# Altium schematic sheet amps.SchDoc
size 209 x 297 mm; SheetNumber: 2; SheetTotal: 2
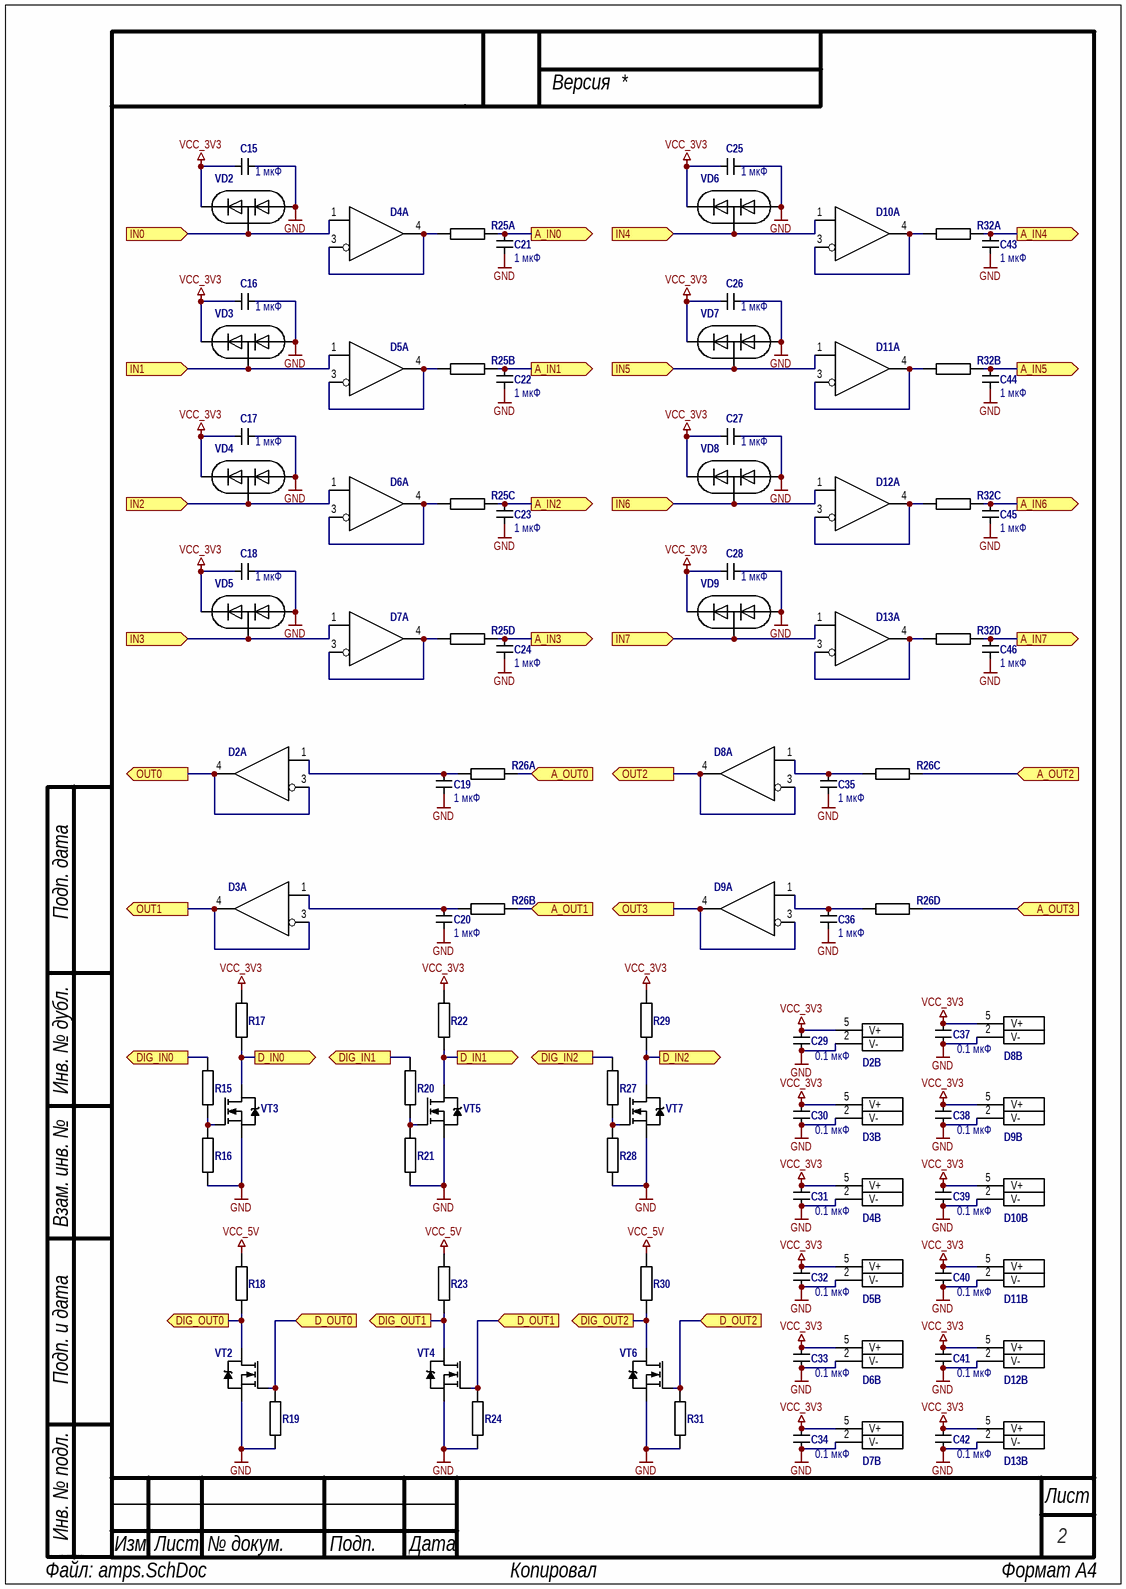
[diagram p0: amps.SchDoc]

## Parts
C15  value 1 мкФ  [CAPC1608X08L]  (hidden comment: C0603_16v_1u)
C16  value 1 мкФ  [CAPC1608X08L]  (hidden comment: C0603_16v_1u)
C17  value 1 мкФ  [CAPC1608X08L]  (hidden comment: C0603_16v_1u)
C18  value 1 мкФ  [CAPC1608X08L]  (hidden comment: C0603_16v_1u)
C19  value 1 мкФ  [CAPC1608X08L]  (hidden comment: C0603_16v_1u)
C20  value 1 мкФ  [CAPC1608X08L]  (hidden comment: C0603_16v_1u)
C21  value 1 мкФ  [CAPC1608X08L]  (hidden comment: C0603_16v_1u)
C22  value 1 мкФ  [CAPC1608X08L]  (hidden comment: C0603_16v_1u)
C23  value 1 мкФ  [CAPC1608X08L]  (hidden comment: C0603_16v_1u)
C24  value 1 мкФ  [CAPC1608X08L]  (hidden comment: C0603_16v_1u)
C25  value 1 мкФ  [CAPC1608X08L]  (hidden comment: C0603_16v_1u)
C26  value 1 мкФ  [CAPC1608X08L]  (hidden comment: C0603_16v_1u)
C27  value 1 мкФ  [CAPC1608X08L]  (hidden comment: C0603_16v_1u)
C28  value 1 мкФ  [CAPC1608X08L]  (hidden comment: C0603_16v_1u)
C29  value 0.1 мкФ  [CAPC1608X08L]  (hidden comment: C0603_50v_0,1u)
C30  value 0.1 мкФ  [CAPC1608X08L]  (hidden comment: C0603_50v_0,1u)
C31  value 0.1 мкФ  [CAPC1608X08L]  (hidden comment: C0603_50v_0,1u)
C32  value 0.1 мкФ  [CAPC1608X08L]  (hidden comment: C0603_50v_0,1u)
C33  value 0.1 мкФ  [CAPC1608X08L]  (hidden comment: C0603_50v_0,1u)
C34  value 0.1 мкФ  [CAPC1608X08L]  (hidden comment: C0603_50v_0,1u)
C35  value 1 мкФ  [CAPC1608X08L]  (hidden comment: C0603_16v_1u)
C36  value 1 мкФ  [CAPC1608X08L]  (hidden comment: C0603_16v_1u)
C37  value 0.1 мкФ  [CAPC1608X08L]  (hidden comment: C0603_50v_0,1u)
C38  value 0.1 мкФ  [CAPC1608X08L]  (hidden comment: C0603_50v_0,1u)
C39  value 0.1 мкФ  [CAPC1608X08L]  (hidden comment: C0603_50v_0,1u)
C40  value 0.1 мкФ  [CAPC1608X08L]  (hidden comment: C0603_50v_0,1u)
C41  value 0.1 мкФ  [CAPC1608X08L]  (hidden comment: C0603_50v_0,1u)
C42  value 0.1 мкФ  [CAPC1608X08L]  (hidden comment: C0603_50v_0,1u)
C43  value 1 мкФ  [CAPC1608X08L]  (hidden comment: C0603_16v_1u)
C44  value 1 мкФ  [CAPC1608X08L]  (hidden comment: C0603_16v_1u)
C45  value 1 мкФ  [CAPC1608X08L]  (hidden comment: C0603_16v_1u)
C46  value 1 мкФ  [CAPC1608X08L]  (hidden comment: C0603_16v_1u)
D2  AMP  [SOT23-5M]  (value not drawn)  (parts A,B of 2)
D3  AMP  [SOT23-5M]  (value not drawn)  (parts A,B of 2)
D4  AMP  [SOT23-5M]  (value not drawn)  (parts A,B of 2)
D5  AMP  [SOT23-5M]  (value not drawn)  (parts A,B of 2)
D6  AMP  [SOT23-5M]  (value not drawn)  (parts A,B of 2)
D7  AMP  [SOT23-5M]  (value not drawn)  (parts A,B of 2)
D8  AMP  [SOT23-5M]  (value not drawn)  (parts A,B of 2)
D9  AMP  [SOT23-5M]  (value not drawn)  (parts A,B of 2)
D10  AMP  [SOT23-5M]  (value not drawn)  (parts A,B of 2)
D11  AMP  [SOT23-5M]  (value not drawn)  (parts A,B of 2)
D12  AMP  [SOT23-5M]  (value not drawn)  (parts A,B of 2)
D13  AMP  [SOT23-5M]  (value not drawn)  (parts A,B of 2)
R15  RES0603_100r  [RESC1608X04N]  (value not drawn)
R16  RES0603_10k  [RESC1608X04N]  (value not drawn)
R17  RES0603_10k  [RESC1608X04N]  (value not drawn)
R18  RES0603_10k  [RESC1608X04N]  (value not drawn)
R19  RES0603_10k  [RESC1608X04N]  (value not drawn)
R20  RES0603_100r  [RESC1608X04N]  (value not drawn)
R21  RES0603_10k  [RESC1608X04N]  (value not drawn)
R22  RES0603_10k  [RESC1608X04N]  (value not drawn)
R23  RES0603_10k  [RESC1608X04N]  (value not drawn)
R24  RES0603_10k  [RESC1608X04N]  (value not drawn)
R25  CAT16-470J4  [CAC-80P320X160-8N]  (value not drawn)  (parts A,B,C,D of 4)
R26  CAT16-470J4  [CAC-80P320X160-8N]  (value not drawn)  (parts A,B,C,D of 4)
R27  RES0603_100r  [RESC1608X04N]  (value not drawn)
R28  RES0603_10k  [RESC1608X04N]  (value not drawn)
R29  RES0603_10k  [RESC1608X04N]  (value not drawn)
R30  RES0603_10k  [RESC1608X04N]  (value not drawn)
R31  RES0603_10k  [RESC1608X04N]  (value not drawn)
R32  CAT16-470J4  [CAC-80P320X160-8N]  (value not drawn)  (parts A,B,C,D of 4)
VD2  BAV199  [SOT95P245X110-3N]  (value not drawn)
VD3  BAV199  [SOT95P245X110-3N]  (value not drawn)
VD4  BAV199  [SOT95P245X110-3N]  (value not drawn)
VD5  BAV199  [SOT95P245X110-3N]  (value not drawn)
VD6  BAV199  [SOT95P245X110-3N]  (value not drawn)
VD7  BAV199  [SOT95P245X110-3N]  (value not drawn)
VD8  BAV199  [SOT95P245X110-3N]  (value not drawn)
VD9  BAV199  [SOT95P245X110-3N]  (value not drawn)
VT2  IRLML2402  [SOT95P245X110-3N]  (value not drawn)
VT3  IRLML2402  [SOT95P245X110-3N]  (value not drawn)
VT4  IRLML2402  [SOT95P245X110-3N]  (value not drawn)
VT5  IRLML2402  [SOT95P245X110-3N]  (value not drawn)
VT6  IRLML2402  [SOT95P245X110-3N]  (value not drawn)
VT7  IRLML2402  [SOT95P245X110-3N]  (value not drawn)

## Ports
A_IN0 (out, see main[2B]), A_IN1 (out, see main[2B]), A_IN2 (out, see main[2B]), A_IN3 (out, see main[2B]), A_IN4 (out, see main[2B]), A_IN5 (out, see main[2B]), A_IN6 (out, see main[2B]), A_IN7 (out, see main[2B]), A_OUT0 (in, see main[2B]), A_OUT1 (in, see main[2B]), A_OUT2 (in, see main[2B]), A_OUT3 (in, see main[2B]), D_IN0 (out, see main[2B]), D_IN1 (out, see main[2B]), D_IN2 (out, see main[2B]), D_OUT0 (in, see main[2B]), D_OUT1 (in, see main[2B]), D_OUT2 (in, see main[2B]), DIG_IN0 (out, see main[1B]), DIG_IN1 (out, see main[1B]), DIG_IN2 (out, see main[1B]), DIG_OUT0 (out, see main[1B]), DIG_OUT1 (out, see main[1B]), DIG_OUT2 (out, see main[1B]), IN0 (in, see main[1B]), IN1 (in, see main[1B]), IN2 (in, see main[1B]), IN3 (in, see main[1B]), IN4 (in, see main[1B]), IN5 (in, see main[1B]), IN6 (in, see main[1B]), IN7 (in, see main[1B]), OUT0 (out, see main[1B]), OUT1 (out, see main[1B]), OUT2 (out, see main[1B]), OUT3 (out, see main[1B])

## Nets
GND: C15.1 C16.1 C17.1 C18.1 C19.1 C20.1 C21.1 C22.1 C23.1 C24.1 C25.1 C26.1 C27.1 C28.1 C29.1 C30.1 C31.1 C32.1 C33.1 C34.1 C35.1 C36.1 C37.1 C38.1 C39.1 C40.1 C41.1 C42.1 C43.1 C44.1 C45.1 C46.1 D2.2(V-) D3.2(V-) D4.2(V-) D5.2(V-) D6.2(V-) D7.2(V-) D8.2(V-) D9.2(V-) D10.2(V-) D11.2(V-) D12.2(V-) D13.2(V-) R16.1 R19.1 R21.1 R24.1 R28.1 R31.1 VD2.1(A) VD3.1(A) VD4.1(A) VD5.1(A) VD6.1(A) VD7.1(A) VD8.1(A) VD9.1(A) VT2.2(Source) VT3.2(Source) VT4.2(Source) VT5.2(Source) VT6.2(Source) VT7.2(Source)
VCC_3V3: C15.2 C16.2 C17.2 C18.2 C25.2 C26.2 C27.2 C28.2 C29.2 C30.2 C31.2 C32.2 C33.2 C34.2 C37.2 C38.2 C39.2 C40.2 C41.2 C42.2 D2.5(V+) D3.5(V+) D4.5(V+) D5.5(V+) D6.5(V+) D7.5(V+) D8.5(V+) D9.5(V+) D10.5(V+) D11.5(V+) D12.5(V+) D13.5(V+) R17.2 R22.2 R29.2 VD2.2(K) VD3.2(K) VD4.2(K) VD5.2(K) VD6.2(K) VD7.2(K) VD8.2(K) VD9.2(K)
VCC_5V: R18.2 R23.2 R30.2
A_IN0: C21.2 R25.8 ; port A_IN0
A_IN1: C22.2 R25.7 ; port A_IN1
A_IN2: C23.2 R25.6 ; port A_IN2
A_IN3: C24.2 R25.5 ; port A_IN3
A_IN4: C43.2 R32.8 ; port A_IN4
A_IN5: C44.2 R32.7 ; port A_IN5
A_IN6: C45.2 R32.6 ; port A_IN6
A_IN7: C46.2 R32.5 ; port A_IN7
A_OUT0: R26.8 ; port A_OUT0
A_OUT1: R26.7 ; port A_OUT1
A_OUT2: R26.6 ; port A_OUT2
A_OUT3: R26.5 ; port A_OUT3
D_IN0: R17.1 VT3.3(Drain) ; port D_IN0
D_IN1: R22.1 VT5.3(Drain) ; port D_IN1
D_IN2: R29.1 VT7.3(Drain) ; port D_IN2
D_OUT0: R19.2 VT2.1(Gate) ; port D_OUT0
D_OUT1: R24.2 VT4.1(Gate) ; port D_OUT1
D_OUT2: R31.2 VT6.1(Gate) ; port D_OUT2
DIG_IN0: R15.1 ; port DIG_IN0
DIG_IN1: R20.1 ; port DIG_IN1
DIG_IN2: R27.1 ; port DIG_IN2
DIG_OUT0: R18.1 VT2.3(Drain) ; port DIG_OUT0
DIG_OUT1: R23.1 VT4.3(Drain) ; port DIG_OUT1
DIG_OUT2: R30.1 VT6.3(Drain) ; port DIG_OUT2
IN0: D4.1(+) VD2.3(C) ; port IN0
IN1: D5.1(+) VD3.3(C) ; port IN1
IN2: D6.1(+) VD4.3(C) ; port IN2
IN3: D7.1(+) VD5.3(C) ; port IN3
IN4: D10.1(+) VD6.3(C) ; port IN4
IN5: D11.1(+) VD7.3(C) ; port IN5
IN6: D12.1(+) VD8.3(C) ; port IN6
IN7: D13.1(+) VD9.3(C) ; port IN7
OUT0: D2.3(-) D2.4(OUT) ; port OUT0
OUT1: D3.3(-) D3.4(OUT) ; port OUT1
OUT2: D8.3(-) D8.4(OUT) ; port OUT2
OUT3: D9.3(-) D9.4(OUT) ; port OUT3
NetC19_2: C19.2 D2.1(+) R26.1
NetC20_2: C20.2 D3.1(+) R26.2
NetC35_2: C35.2 D8.1(+) R26.3
NetC36_2: C36.2 D9.1(+) R26.4
NetD4_3: D4.3(-) D4.4(OUT) R25.1
NetD5_3: D5.3(-) D5.4(OUT) R25.2
NetD6_3: D6.3(-) D6.4(OUT) R25.3
NetD7_3: D7.3(-) D7.4(OUT) R25.4
NetD10_3: D10.3(-) D10.4(OUT) R32.1
NetD11_3: D11.3(-) D11.4(OUT) R32.2
NetD12_3: D12.3(-) D12.4(OUT) R32.3
NetD13_3: D13.3(-) D13.4(OUT) R32.4
NetR15_2: R15.2 R16.2 VT3.1(Gate)
NetR20_2: R20.2 R21.2 VT5.1(Gate)
NetR27_2: R27.2 R28.2 VT7.1(Gate)

## Notes on the sheet
- Версия
- Подп. дата
- Инв. № дубл.
- Взам. инв. №
- Подп. и дата
- Инв. № подл.
- Изм.
- Лист
- № докум.
- Подп.
- Дата
- Файл:
- ALTIUM GOSTBOM2.0 KEV
- Копировал
- Формат А4

## Library data of the parts
C15-C28 C35 C36 C43-C46 = CMP-001-00002-10: Чип 0603 16в 1мкФ; Bom_name: ЧИП-0603-X7R-16 В-1 мкФ ±10%; dopusk: ±10%; d_type: X7R; planar: 1; temp_range: -55...+155; PlaceALL_name: 0603-X7R-1u; PlaceALL_value: 1u; Type: 0603; napr: 16 В
C29-C34 C37-C42 = CMP-001-00000-11: Чип 0603 50в 0,1мкФ; Bom_name: ЧИП-0603-X7R-50 В-0.1 мкФ ±10%; dopusk: ±10%; d_type: X7R; planar: 1; temp_range: -55...+155; PlaceALL_name: 0603-X7R-0.1u; PlaceALL_value: 0.1u; Type: 0603; napr: 50 В
D2-D13 = LMV321IDBVR: ОУ; name: LMV321IDBVR
R15 R20 R27 = CMP-00024-9: Чип 0603 100 Ом; Bom_name: ЧИП-0603 -100 Ом ±5%; dopusk: ±5%; planar: 1; value: 100 Ом; temp_range: -55...+155; PlaceALL_name: 0603-100r; PlaceALL_value: 100r; Type: 0603
R16-R19 R21-R24 R28-R31 = CMP-00004-13: Чип 0603 10 кОм; Bom_name: ЧИП-0603 -10 кОм ±5%; dopusk: ±5%; planar: 1; value: 10 кОм; temp_range: -55...+155; PlaceALL_name: 0603-10k; PlaceALL_value: 10k; Type: 0603
R25 R26 R32 = CMP-00001-8: Сборка 47 Ом; value: 47 Ом; dopusk: ±5%; planar: 1; temp_range: -55...+155; Bom_name: CAT16-470J4; PlaceALL_name: CAT16-470J4
VD2-VD9 = CMP-004-00001-6: Диодная сборка BAV199; Bom_name: Диод BAV199; planar: 1; temp_range: -40…+150; ComponentLink1URL: https://assets.nexperia.com/documents/data-sheet/BAV199.pdf; PlaceALL_name: BAV199
VT2-VT7 = CMP-00035-3: sot-23 HEXFET MOSFET; Bom_name: Транзистор IRLML2402TR; planar: 1; temp_range: -55…+150; PlaceALL_name: IRLML2402